# EAGLE design Timer (EAGLE 6.0)
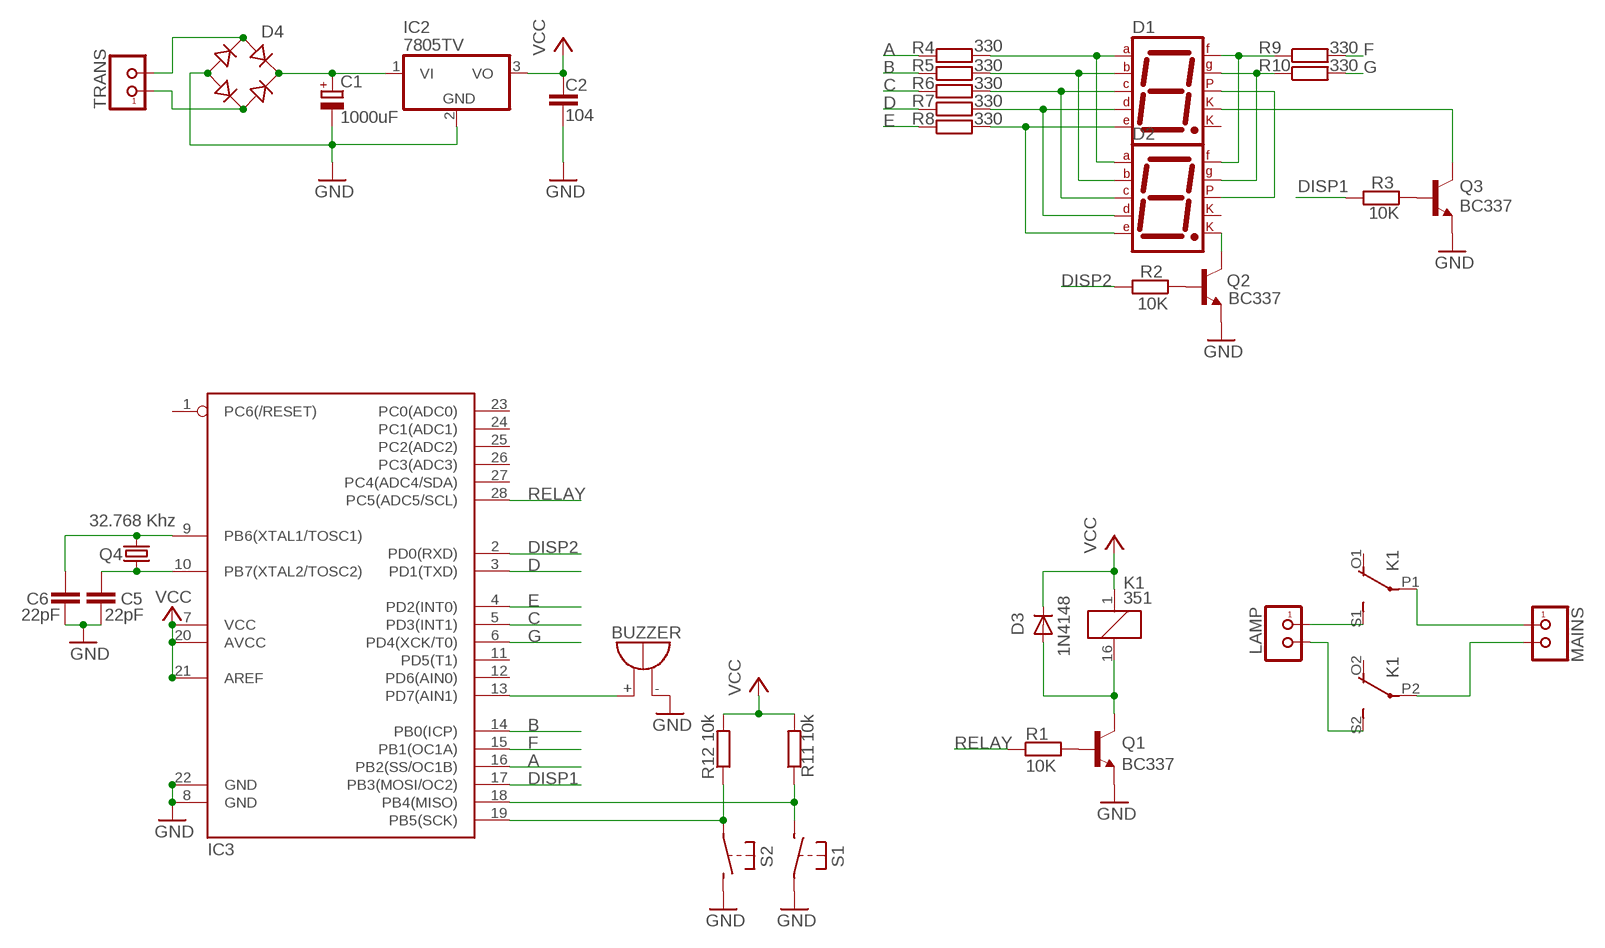
[diagram p0: schematic, sheet 1]

## Parts
BUZZER  F/HMB  [F/HMB]
C1  1000uF  C-POL13-SIDE  [C-TT2D13-SIDE]
C2  104  CC-22X6(FAKI)  [C-22X6(FAKI)]
C5  22pF  CC-22X6(FAKI)  [C-22X6(FAKI)]
C6  22pF  CC-22X6(FAKI)  [C-22X6(FAKI)]
D1  7SEG-CK  [7SEG-13]
D2  7SEG-CK  [7SEG-13]
D3  1N4148  1N4148DO35-10  [DO35-10]
D4  RECTIFIER-1A  [RECTIFIER-1A]
IC2  7805TV  [TO220V]
IC3  ATMEGA-8-P  [DIL28-3]
K1  351  [351]
LAMP  KLEMESX2  [KLEMESX2]
MAINS  KLEMESX2  [KLEMESX2]
Q1  BC337  BC548  [TO92-EBC]
Q2  BC337  BC548  [TO92-EBC]
Q3  BC337  BC548  [TO92-EBC]
Q4  32.768 Khz  CRYSTALTC38  [TC38]
R1  10K  R0207/10  [R0270/10]
R2  10K  R0207/10  [R0270/10]
R3  10K  R0207/10  [R0270/10]
R4  330  R0207/10  [R0270/10]
R5  330  R0207/10  [R0270/10]
R6  330  R0207/10  [R0270/10]
R7  330  R0207/10  [R0270/10]
R8  330  R0207/10  [R0270/10]
R9  330  R0207/10  [R0270/10]
R10  330  R0207/10  [R0270/10]
R11  10k  R0207/10  [R0270/10]
R12  10k  R0207/10  [R0270/10]
S1  SWITCH  [SW-BT]
S2  SWITCH  [SW-BT]
TRANS  KLEMESX2  [KLEMESX2]

## Nets
A: IC3.16(PB2(SS/OC1B)) R4.1
B: IC3.14(PB0(ICP)) R5.1
C: IC3.5(PD3(INT1)) R6.1
D: IC3.3(PD1(TXD)) R7.1
DISP1: IC3.17(PB3(MOSI/OC2)) R3.2
DISP2: IC3.2(PD0(RXD)) R2.2
E: IC3.4(PD2(INT0)) R8.1
F: IC3.15(PB1(OC1A)) R9.2
G: IC3.6(PD4(XCK/T0)) R10.2
GND: BUZZER.- C1.- C2.2 C5.2 C6.2 D4.- IC2.2(GND) IC3.8(GND) IC3.22(GND) Q1.E Q2.E Q3.E S1.P$1(P) S2.P$2(S)
N$1: D4.AC1 TRANS.2
N$2: K1.P2(3:P) MAINS.2
N$3: C1.+ D4.+ IC2.1(VI)
N$4: D1.4(C) D2.4(C) R6.2
N$5: C5.1 IC3.10(PB7(XTAL2/TOSC2)) Q4.1
N$6: K1.P1(2:P) MAINS.1
N$7: D1.6(B) D2.6(B) R5.2
N$8: D1.7(A) D2.7(A) R4.2
N$9: D1.2(D) D2.2(D) R7.2
N$10: D1.1(E) D2.1(E) R8.2
N$11: D1.9(F) D2.9(F) R9.1
N$12: D1.5(DP) D2.5(DP)
N$13: Q3.B R3.1
N$14: D1.10(G) D2.10(G) R10.1
N$15: K1.S2(3:S) LAMP.2
N$16: C6.1 IC3.9(PB6(XTAL1/TOSC1)) Q4.2
N$17: Q2.B R2.1
N$18: D2.8(CK2) Q2.C
N$19: D1.3(CK1) Q3.C
N$20: BUZZER.+ IC3.13(PD7(AIN1))
N$21: IC3.19(PB5(SCK)) R12.1 S2.P$1(P)
N$22: D3.A K1.16 Q1.C
N$23: Q1.B R1.2
N$26: D4.AC2 TRANS.1
N$27: IC3.18(PB4(MISO)) R11.1 S1.P$2(S)
N$28: K1.S1(2:S) LAMP.1
RELAY: IC3.28(PC5(ADC5/SCL)) R1.1
VCC: C2.1 D3.C IC2.3(VO) IC3.7(VCC) IC3.20(AVCC) IC3.21(AREF) K1.1 R11.2 R12.2
Unconnected: D1.8(CK2) D2.3(CK1) IC3.1(PC6(/RESET)) IC3.11(PD5(T1)) IC3.12(PD6(AIN0)) IC3.23(PC0(ADC0)) IC3.24(PC1(ADC1)) IC3.25(PC2(ADC2)) IC3.26(PC3(ADC3)) IC3.27(PC4(ADC4/SDA)) K1.O1(2:O) K1.O2(3:O)

## Library data of the parts
BUZZER = buzzer:F/HMB: BUZZER Source: Buerklin
C1 = candrian:C-POL
C2 C5 C6 = candrian:C
D1 D2 = special:7SEG-CK: 7-segment DISPLAY single cathode, 13 mm
D3 = diode:1N4148: DIODE high speed (Philips)
D4 = candrian:RECTIFIER-1A
IC2 = linear:78*: Positive VOLTAGE REGULATOR Source: http://cache.national.com/ds/LM/LM78L05.pdf http://www.fairchildsemi.com/ds/LM/LM7805.pdf
IC3 = candrian:ATMEGA-8-P
K1 = relay:351: RELAY 2 x switch, Omron
LAMP MAINS TRANS = candrian:KLEMESX2
Q1-Q3 = transistor-npn:BC548*: NPN Transistor
Q4 = candrian:CRYSTAL
R1-R12 = candrian:R
S1 S2 = candrian:SWITCH

## Board
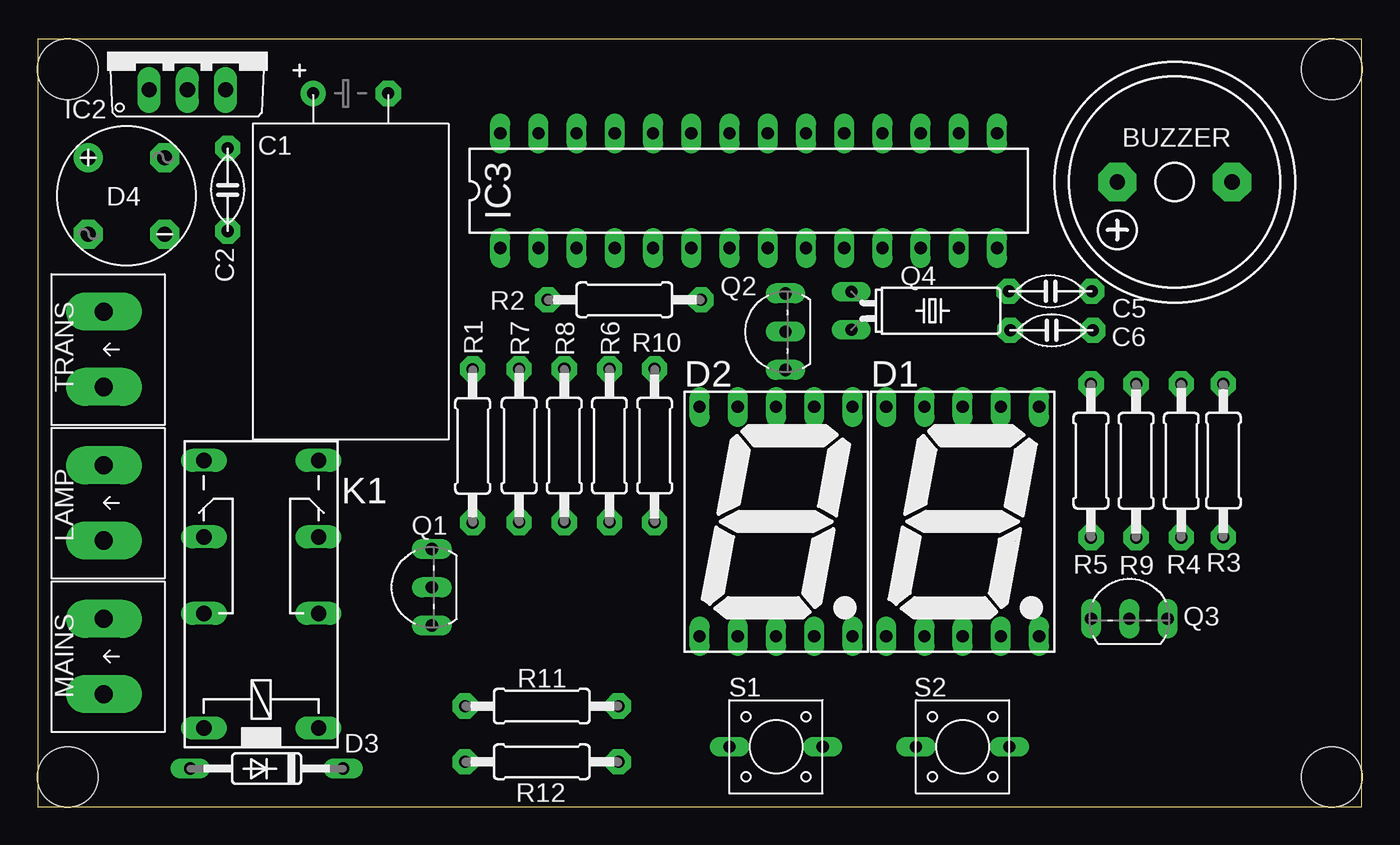
[diagram p1: board, top side]
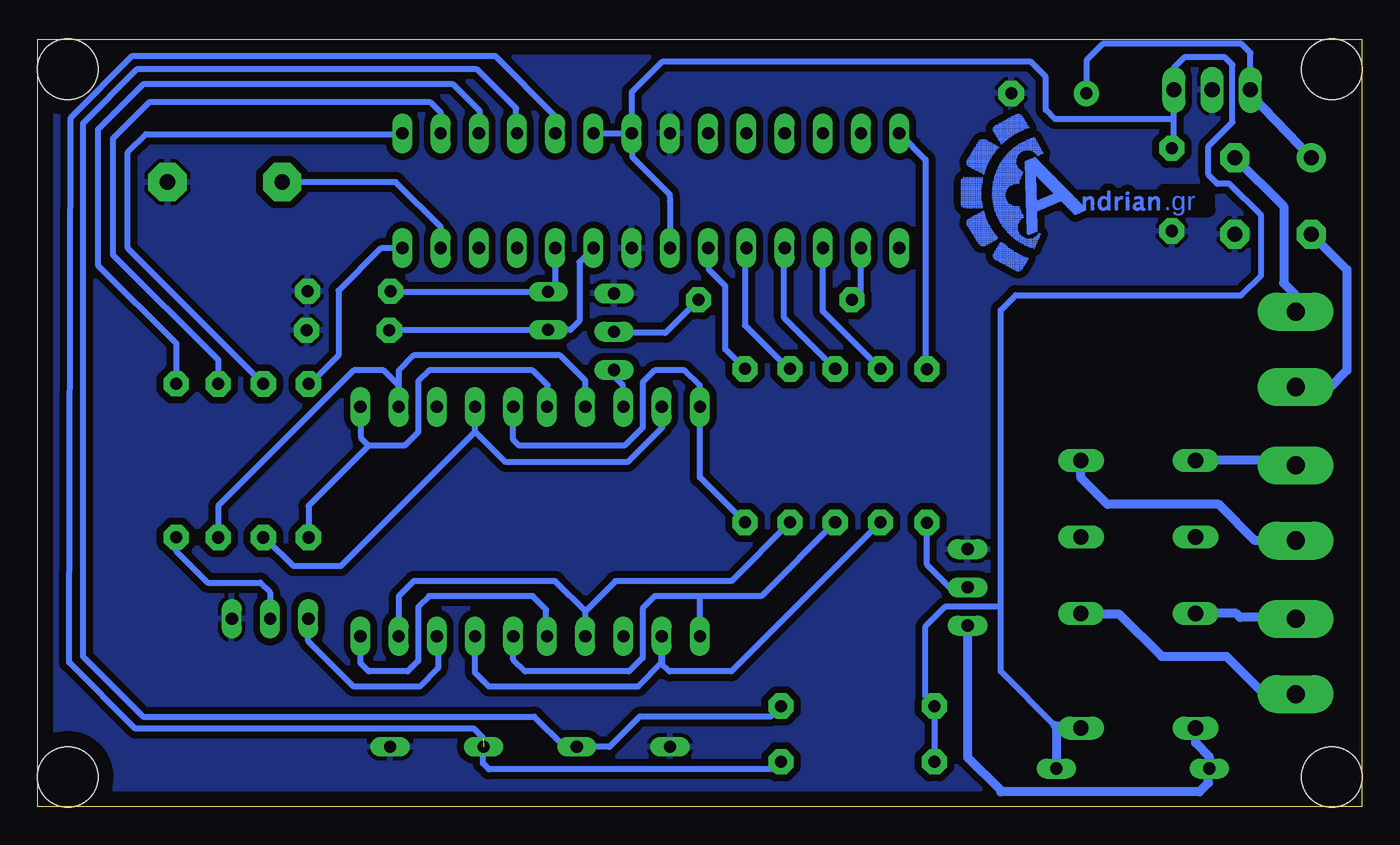
[diagram p2: board, bottom side, seen from below]

Size 88 x 51 mm. Coordinates in mm from the lower left corner, seen from the top.
Outline: 0,0 88,0 88,51 0,51 0,0
Copper layers (1*16): Top 0.035mm / dielectric 1.5mm / Bottom 0.035mm
Design rules: minimum track width 10mil, minimum drill 24mil, track to track 18mil, track to pad 18mil, pad to pad 18mil, via to via 8mil, smd to smd 8mil, copper to edge 40mil, drill to drill 8mil, minimum pad ring 10mil, minimum via ring 8mil, stop-mask expansion 4mil, vias tented up to drill 0mil, thermal gap 10mil
Holes 4 mm at 86,2 86,49 2,49 2,2

### Footprints (pad centres in the part's own frame; a part is rotated, then mirrored left to right if it is on the bottom)
F/HMB = drill 1.016 pad 2.54 octagon: + 3.81,0; - -3.81,0
C-TT2D13-SIDE = drill 0.8 pad 1.676: + -2,-2.5 | drill 0.8 pad 1.676 octagon: - -2,2.5
C-22X6(FAKI) = drill 0.8 pad 1.676 octagon: 1 -2.75,0; 2 2.75,0
7SEG-13 = drill 0.813 long: 1 -5.08,-7.62; 2 -2.54,-7.62; 3 0,-7.62; 4 2.54,-7.62; 5 5.08,-7.62; 6 5.08,7.62; 7 2.54,7.62; 8 0,7.62; 9 -2.54,7.62; 10 -5.08,7.62
DO35-10 = drill 0.813 long: A 5.08,0; C -5.08,0
RECTIFIER-1A = drill 1 pad 1.93: + -2.54,2.54 | drill 1 pad 1.93 octagon: - 2.54,-2.54; AC1 2.54,2.54; AC2 -2.54,-2.54
TO220V = drill 1.016 long: 1 -2.54,-2.54; 2 0,-2.54; 3 2.54,-2.54
DIL28-3 = drill 0.813 long: 1 -15.24,-3.81; 2 -12.7,-3.81; 3 -10.16,-3.81; 4 -7.62,-3.81; 5 -5.08,-3.81; 6 -2.54,-3.81; 7 0,-3.81; 8 2.54,-3.81; 9 5.08,-3.81; 10 7.62,-3.81; 11 10.16,-3.81; 12 12.7,-3.81; 13 15.24,-3.81; 14 17.78,-3.81; 15 17.78,3.81; 16 15.24,3.81; 17 12.7,3.81; 18 10.16,3.81; 19 7.62,3.81; 20 5.08,3.81; 21 2.54,3.81; 22 0,3.81; 23 -2.54,3.81; 24 -5.08,3.81; 25 -7.62,3.81; 26 -10.16,3.81; 27 -12.7,3.81; 28 -15.24,3.81
351 = drill 1.016 long: 1 -3.81,-3.81; 16 -3.81,3.81; O1 8.89,-3.81; O2 8.89,3.81; P1 3.81,-3.81; P2 3.81,3.81; S1 13.97,-3.81; S2 13.97,3.81
KLEMESX2 = drill 1.2 pad 2.54 long: 1 -2.5,0; 2 2.5,0
TO92-EBC = drill 0.813 long: B 0,-1.27; C -2.54,-1.27; E 2.54,-1.27
TC38 = drill 0.8 pad 1.27 long: 1 -1.27,-3.81; 2 1.27,-3.81
R0270/10 = drill 0.8 pad 1.676 octagon: 1 -5.1,0; 2 5.1,0
SW-BT = drill 0.8 long: P$1 -3.1,0; P$2 3.1,0

### Placement (x,y rotation side)
BUZZER  75.56,41.51 180 top
C1  20.8,45.4 270 top
C2  12.63,41.01 270 top
C5  67.3,34.26 0 top
C6  67.38,31.66 0 top
D1  61.47,18.96 0 top
D2  49.07,18.96 0 top
D3  15.22,2.55 180 top
D4  5.9,40.6 0 top
IC2  9.95,50.18 0 top
IC3  45.98,40.94 0 top
K1  14.86,9.05 90 top
LAMP  4.4,20.2 90 top
MAINS  4.4,10 90 top
Q1  24.93,14.59 90 top
Q2  48.43,31.57 90 top
Q3  72.55,13.77 0 top
Q4  57.88,32.96 270 top
R1  28.91,23.99 270 top
R2  38.99,33.69 180 top
R3  78.79,23.01 90 top
R4  76,23 270 top
R5  70,23 270 top
R6  38,24 270 top
R7  32,24 270 top
R8  35,24 270 top
R9  73,23 90 top
R10  41,24 90 top
R11  33.5,6.7 180 top
R12  33.5,3 180 top
S1  49.07,4 0 top
S2  61.47,4 0 top
TRANS  4.4,30.4 90 top
U$1  [CANDRIAN-LOGO/SMALL/BOTTOM]  18,41 0 top

### Tracks (layer width: path | path; a pad name or v marks a point on that pad's centre or on a via)
A
  Bottom 0.406: IC3.16 61.2,44.77 61.2,46.1 61.9,46.8 80.6,46.8 83,44.4 83,36.7 76,29.7 R4.1
B
  Bottom 0.406: IC3.14 63.79,37.1 65.2,37.1 68,34.3 68,30 69.9,28.1 R5.1
C
  Bottom 0.406: IC3.5 41,37.03 41,32 38,29 R6.1
D
  Bottom 0.406: R7.1 35.82,32.92 IC3.3
DISP1
  Bottom 0.406: IC3.17 58.6,44.83 58.6,46.2 60.4,48 81,48 84,45 84,36 78.79,30.79 R3.2
DISP2
  Bottom 0.406: R2.2 33.28,34.08 IC3.2
E
  Bottom 0.406: R8.1 38.4,32.5 38.4,37.1 IC3.4
F
  Bottom 0.406: R9.2 82,37.1 82,43.5 80.8,44.7 63.8,44.7 IC3.15
G
  Bottom 0.406: R10.2 42.3,30.4 42.3,34.6 43.4,35.7 43.4,37.1 43.41,37.1 IC3.6
GND
  pour Bottom: 0,51 88,51 88,0 24,0 24,34 0,34
N$1
  Bottom 0.61: D4.AC1 5.2,39.9 5.2,34.8 4.47,34.07 TRANS.2
N$2
  Bottom 0.61: MAINS.2 4.48,12.6 8.1,12.6 8.36,12.86 K1.P2
N$3
  Bottom 0.406: IC2.1 7.4,47.35 7.4,50.1 8,50.7 17.2,50.7 18.3,49.6 C1.+
  Bottom 0.61: IC2.1 7.36,47.29 D4.+
N$4
  Bottom 0.406: D2.4 51.6,13 | 51.6,13 53.6,15 63,15 64.01,13.99 D1.4 | R6.2 41.9,15 49.6,15 51.6,13
N$5
  Bottom 0.406: C5.1 64.52,34.23 Q4.1 54.07,34.27 54.1,34.3 53.6,34.3 IC3.10
N$6
  Bottom 0.61: MAINS.1 6.59,7.59 9,10 13.31,10 16.11,12.8 18.7,12.8 18.67,12.83 K1.P1
N$7
  Bottom 0.406: D2.6 54.1,26.63 54.1,28 55.1,29 62,29 62.7,28.3 62.7,24.9 63.6,24 66,24 | 66,24 66.5,24.5 66.5,26.53 D1.6 | 66,24 70,20 R5.2
N$8
  Bottom 0.406: D2.7 51.6,28.3 53.3,30 63,30 64.01,28.99 D1.7 64,28 65,29 67,29 76,20 R4.2
N$9
  Bottom 0.406: D1.2 58.93,8.93 58,8 48.1,8 46.5,9.6 46.5,11.31 D2.2 46.53,9.53 46,9 41.9,9 R7.2
N$10
  Bottom 0.406: D2.1 44,14 | 44,14 47,14 47.8,13.2 47.8,9.9 48.7,9 55.6,9 56.39,9.79 D1.1 | R8.2 39.9,14 44,14
N$11
  Bottom 0.406: 58.93,24.93 D1.9 | D2.9 46.5,26.55 46.5,25.2 48.8,22.9 56.9,22.9 58.93,24.93 | 58.93,24.93 67.86,16 71,16 72.8,17.8 | 72.8,17.8 73,18 | R9.1 72.9,17.8 72.8,17.8
N$12
  Bottom 0.406: D2.5 54.2,11.39 54.2,13.1 55.1,14 62,14 62.7,13.3 62.7,9.7 63.4,9 66,9 66.55,9.55 D1.5
N$13
  Bottom 0.406: R3.1 78.79,16.99 76.7,14.9 73.2,14.9 72.55,14.25 Q3.B
N$14
  Bottom 0.406: D1.10 56.39,24.39 56,24 49,24 47.8,25.2 47.8,28.2 47,29 45,29 44,28 D2.10 43.99,21.89 R10.1
N$15
  Bottom 0.61: LAMP.2 4.72,23.02 K1.S2
N$16
  Bottom 0.406: IC3.9 52,36.19 52,32.3 52.6,31.7 54,31.7 54.01,31.69 Q4.2 64.6,31.69 C6.1
N$17
  Bottom 0.406: R2.1 46.28,31.5 49.7,31.5 Q2.B
N$18
  Bottom 0.406: D2.8 49.1,26.61 49.1,28 49.7,28.6 Q2.C
N$19
  Bottom 0.406: D1.3 61.4,11.27 61.4,9.2 62.6,8 67,8 70.01,11.01 Q3.C
N$20
  Bottom 0.406: IC3.13 61.2,37.15 61.2,38.5 64.2,41.5 BUZZER.+
N$21  (1 unrouted)
  Bottom 0.406: R12.1 39.1,2.5 58,2.5 58.4,2.9 58.4,4.6 59,5.2 81.5,5.2 85.9,9.6 85.8,45.8 81.7,49.9 57.6,49.9 53.6,45.9 IC3.19
N$22
  Bottom 0.406: 10.2,2.6 10.2,2.5 10.19,2.5 D3.A | 24,1.1 24,1
  Bottom 0.61: 24,1 10.8,1 10.2,1.6 10.2,2.5 | K1.16 11.05,4.25 10.14,3.34 D3.A | Q1.C 26.2,3.3 24,1.1
N$23
  Bottom 0.406: Q1.B 27.4,14.6 28.9,16.1 R1.2
N$26
  Bottom 0.61: D4.AC2 1,35.7 1,29 2.14,27.86 TRANS.1
N$27
  Bottom 0.406: R11.1 39.3,6 48,6 50,4 S1.P$2 53,4 55,6 81,6 85,10 85,45.4 81.4,49 58.8,49 56.2,46.4 56.2,44.81 IC3.18
N$28
  Bottom 0.61: LAMP.1 7.1,17.7 9.5,20.1 16.9,20.1 18.67,21.87 K1.S1
RELAY
  Bottom 0.406: IC3.28 29,43.01 29,29 R1.1
VCC
  Bottom 0.406: IC3.20 IC3.21 | IC2.3 12.53,45.7 20.4,45.7 21,46.3 21,48.5 22,49.5 46.5,49.5 48.52,47.48 IC3.21 | IC3.21 48.5,44.75 48.5,43.2 46,40.7 45.98,40.21 IC3.7 45.9,37.21 | 18.7,5.4 18.67,5.37 | C2.1 12.5,43.89 12.5,47.33 IC2.3 | 24,13.3 24,9 20.4,5.4 20.3,5.3 | 24,13.3 27.7,13.3 29,12 29,7.3 R11.2 R12.2 | 24,13.3 24,33 23,34 8,34 6.7,35.3 6.7,39.3 8.8,41.4 9.6,41.4 10.2,42 10.2,43.9 8.6,45.5 8.6,49.3 9.1,49.8 11.8,49.8 12.49,49.11 IC2.3
  Bottom 0.61: 20.4,5.4 18.7,5.4 | 18.67,5.37 K1.1 | 20.3,5.3 D3.C